# EAGLE design extruder-flex-heater (EAGLE 6.4)
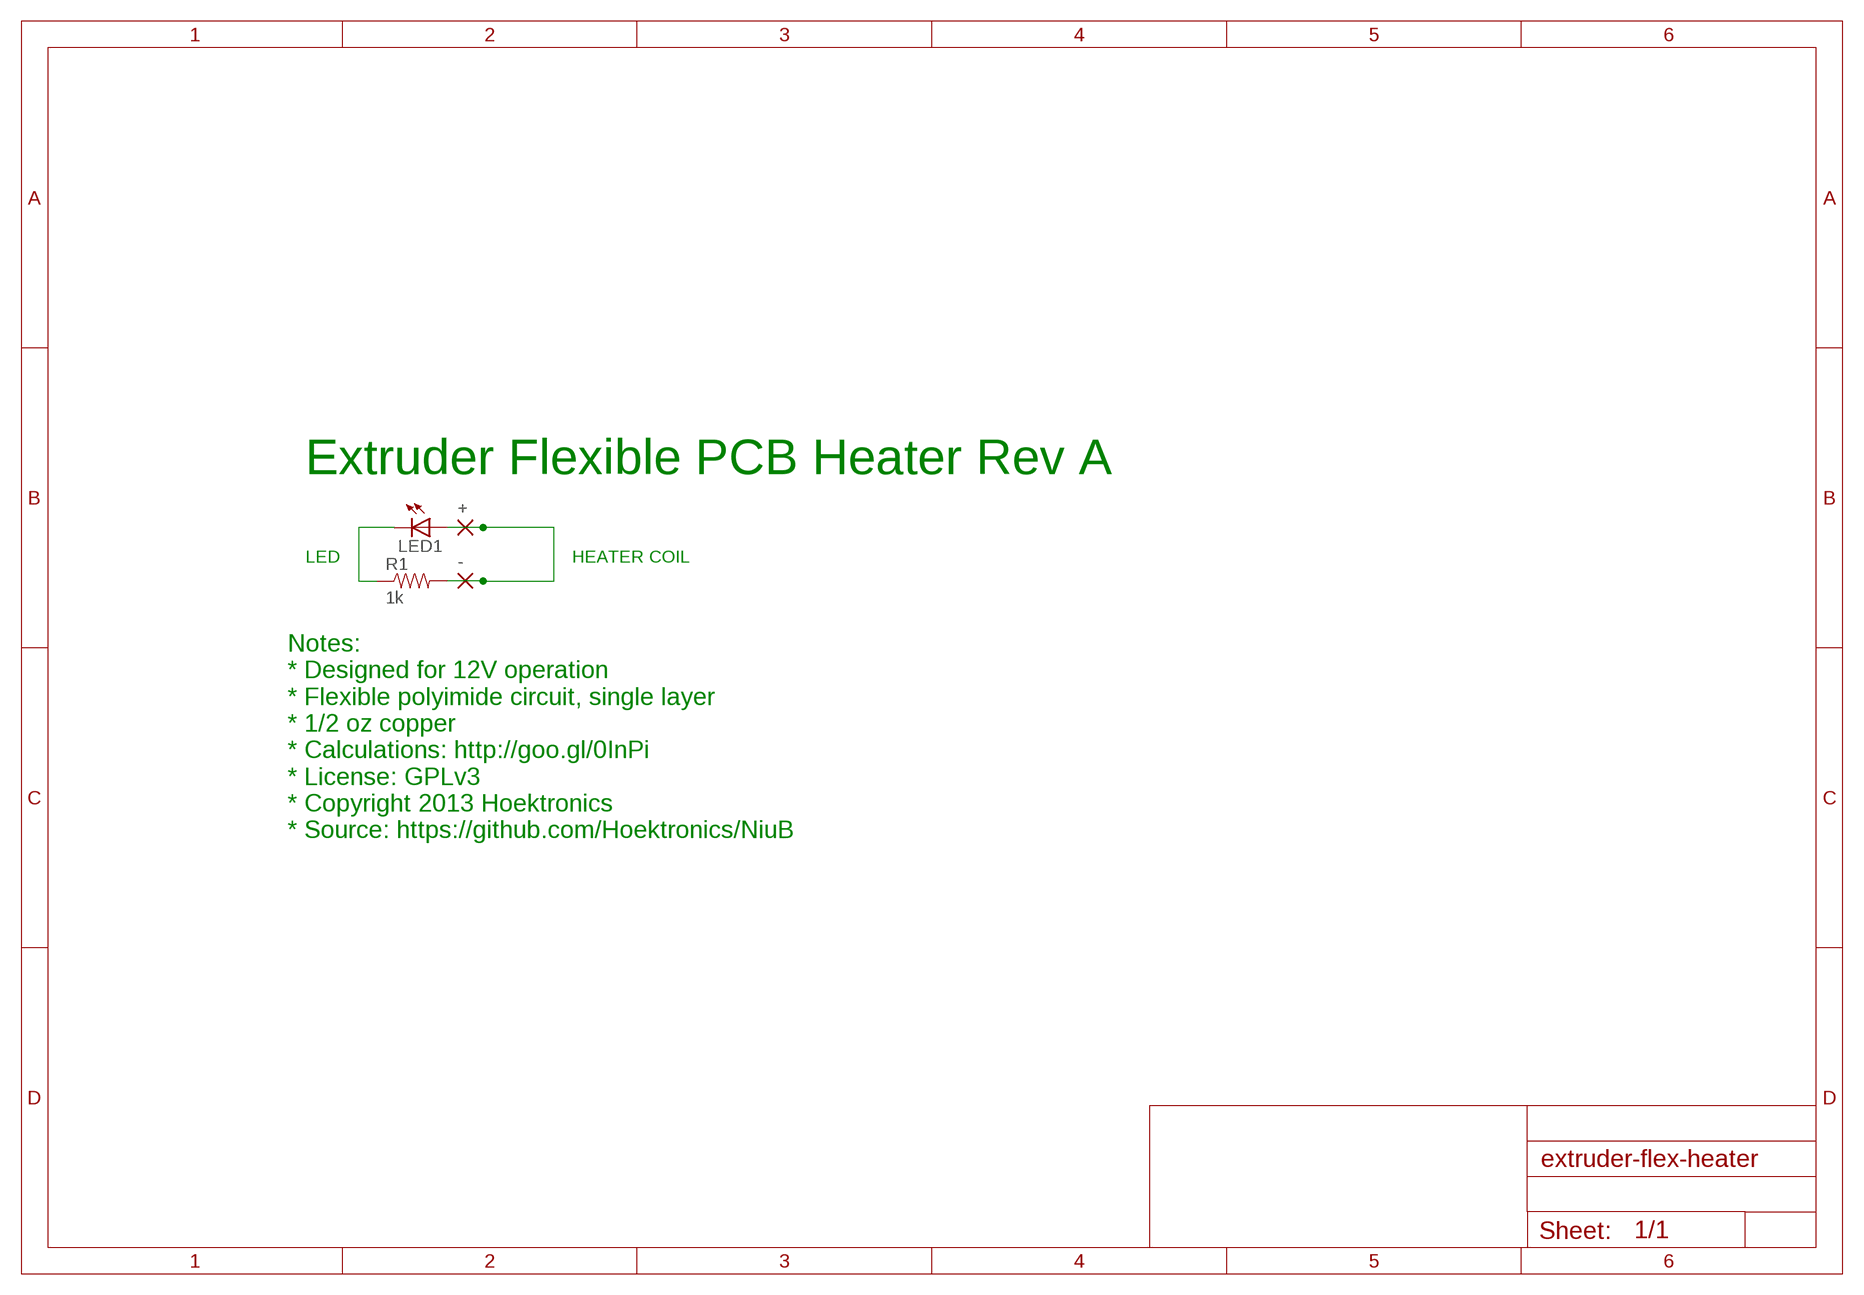
[diagram p0: schematic, sheet 1]

## Parts
+  SMD2  [SMD1,27-2,54]
-  SMD2  [SMD1,27-2,54]
LED1  LED0805  [0805-LED]
R1  1k  RESISTOR0805  [0805-RC]

## Nets
HEATER: +.1(P) -.1(P) LED1.A R1.2
N$1: LED1.C R1.1

## Notes on the sheet
- Extruder Flexible PCB Heater Rev A
- LED | HEATER COIL
- Notes:
  * Designed for 12V operation
  * Flexible polyimide circuit, single layer
  * 1/2 oz copper
  * Calculations: http://goo.gl/0InPi
  * License: GPLv3
  * Copyright 2013 Hoektronics
  * Source: https://github.com/Hoektronics/NiuB

## Library data of the parts
+ - = wirepad:SMD2: SMD PAD
LED1 = Hoektronics:LED: LEDs Standard schematic elements and footprints for 5mm, 3mm, 1206, and 0603 sized LEDs. 5mm - Spark Fun Electronics SKU : COM-00529 (and others)
R1 = Hoektronics:RESISTOR: Resistor Basic schematic elements and footprints for 0603, 1206, and PTH 1/10th watt (small) resistors.

## Board
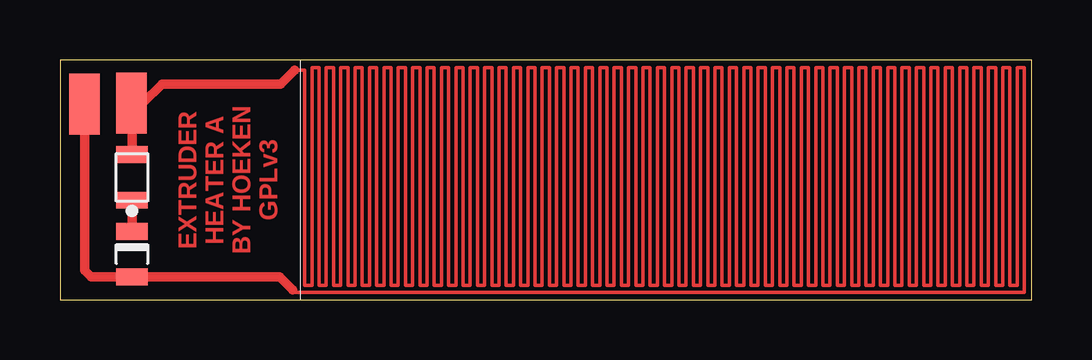
[diagram p1: board, top side]

Size 40.5 x 10 mm. Coordinates in mm from the lower left corner, seen from the top.
Outline: 0,0 40.5,0 40.5,10 0,10 0,0
Copper layers (1*16): Top 0.035mm / dielectric 1.5mm / Bottom 0.035mm
Design rules "default *": minimum track width 0.075mm, minimum drill 0.2mm, track to track 0.075mm, track to pad 0.075mm, pad to pad 0.075mm, via to via 0.075mm, smd to smd 0.075mm, copper to edge 0.2mm, drill to drill 8mil, minimum pad ring 10mil, minimum via ring 8mil, stop-mask expansion 4mil, vias tented up to drill 0mil, thermal gap 10mil

### Footprints (pad centres in the part's own frame; a part is rotated, then mirrored left to right if it is on the bottom)
SMD1,27-2,54 = smd 1.27 x 2.54: 1 0,0
0805-LED = smd 0.7 x 1.3: A 0.95,0; C -0.95,0
0805-RC = smd 0.7 x 1.3: 1 -0.95,0; 2 0.95,0

### Placement (x,y rotation side)
+  1.03,8.16 0 top
-  2.97,8.19 180 top
LED1  3,1.9 270 top
R1  3,5.1 90 top

### Tracks (layer width: path | path; a pad name or v marks a point on that pad's centre or on a via)
HEATER
  Top 0.15: 9.78,9.57 10.2,9.57 10.2,0.6 10.5,0.6 10.5,9.68 10.8,9.68 10.8,0.6 11.1,0.6 11.1,9.68 11.4,9.68 11.4,0.6 11.7,0.6 11.7,9.68 12,9.68 12,0.6 12.3,0.6 12.3,9.68 12.6,9.68 12.6,0.6 12.9,0.6 12.9,9.68 13.2,9.68 13.2,0.6 13.5,0.6 13.5,9.68 13.8,9.68 13.8,0.6 14.1,0.6 14.1,9.68 14.4,9.68 14.4,0.6 14.7,0.6 14.7,9.68 15,9.68 15,0.6 15.3,0.6 15.3,9.68 15.6,9.68 15.6,0.6 15.9,0.6 15.9,9.68 16.2,9.68 16.2,0.6 16.5,0.6 16.5,9.68 16.8,9.68 16.8,0.6 17.1,0.6 17.1,9.68 17.4,9.68 17.4,0.6 17.7,0.6 17.7,9.68 18,9.68 18,0.6 18.3,0.6 18.3,9.68 18.6,9.68 18.6,0.6 18.9,0.6 18.9,9.68 19.2,9.68 19.2,0.6 19.5,0.6 19.5,9.68 19.8,9.68 19.8,0.6 20.1,0.6 20.1,9.68 20.4,9.68 20.4,0.6 20.7,0.6 20.7,9.68 21,9.68 21,0.6 21.3,0.6 21.3,9.68 21.6,9.68 21.6,0.6 21.9,0.6 21.9,9.68 22.2,9.68 22.2,0.6 22.5,0.6 22.5,9.68 22.8,9.68 22.8,0.6 23.1,0.6 23.1,9.68 23.4,9.68 23.4,0.6 23.7,0.6 23.7,9.68 24,9.68 24,0.6 24.3,0.6 24.3,9.68 24.6,9.68 24.6,0.6 24.9,0.6 24.9,9.68 25.2,9.68 25.2,0.6 25.5,0.6 25.5,9.68 25.8,9.68 25.8,0.6 26.1,0.6 26.1,9.68 26.4,9.68 26.4,0.6 26.7,0.6 26.7,9.68 27,9.68 27,0.6 27.3,0.6 27.3,9.68 27.6,9.68 27.6,0.6 27.9,0.6 27.9,9.68 28.2,9.68 28.2,0.6 28.5,0.6 28.5,9.68 28.8,9.68 28.8,0.6 29.1,0.6 29.1,9.68 29.4,9.68 29.4,0.6 29.7,0.6 29.7,9.68 30,9.68 30,0.6 30.3,0.6 30.3,9.68 30.6,9.68 30.6,0.6 30.9,0.6 30.9,9.68 31.2,9.68 31.2,0.6 31.5,0.6 31.5,9.68 31.8,9.68 31.8,0.6 32.1,0.6 32.1,9.68 32.4,9.68 32.4,0.6 32.7,0.6 32.7,9.68 33,9.68 33,0.6 33.3,0.6 33.3,9.68 33.6,9.68 33.6,0.6 33.9,0.6 33.9,9.68 34.2,9.68 34.2,0.6 34.5,0.6 34.5,9.68 34.8,9.68 34.8,0.6 35.1,0.6 35.1,9.68 35.4,9.68 35.4,0.6 35.7,0.6 35.7,9.68 36,9.68 36,0.6 36.3,0.6 36.3,9.68 36.6,9.68 36.6,0.6 36.9,0.6 36.9,9.68 37.2,9.68 37.2,0.6 37.5,0.6 37.5,9.68 37.8,9.68 37.8,0.6 38.1,0.6 38.1,9.68 38.4,9.68 38.4,0.6 38.7,0.6 38.7,9.68 39,9.68 39,0.6 39.3,0.6 39.3,9.68 39.6,9.68 39.6,0.6 39.9,0.6 39.9,9.68 40.2,9.68 40.2,0.3 9.8,0.3 9.7,0.4
  Top 0.4: 9.78,9.57 9.2,9 4.25,9 3.44,8.19 -.1 3,8.16 R1.2 | +.1 1.03,1.22 1.3,0.95 LED1.A 9.15,0.95 9.7,0.4
N$1
  Top 0.4: LED1.C R1.1

### Text on the board
Top: EXTRUDER / HEATER A / BY HOEKEN / GPLv3